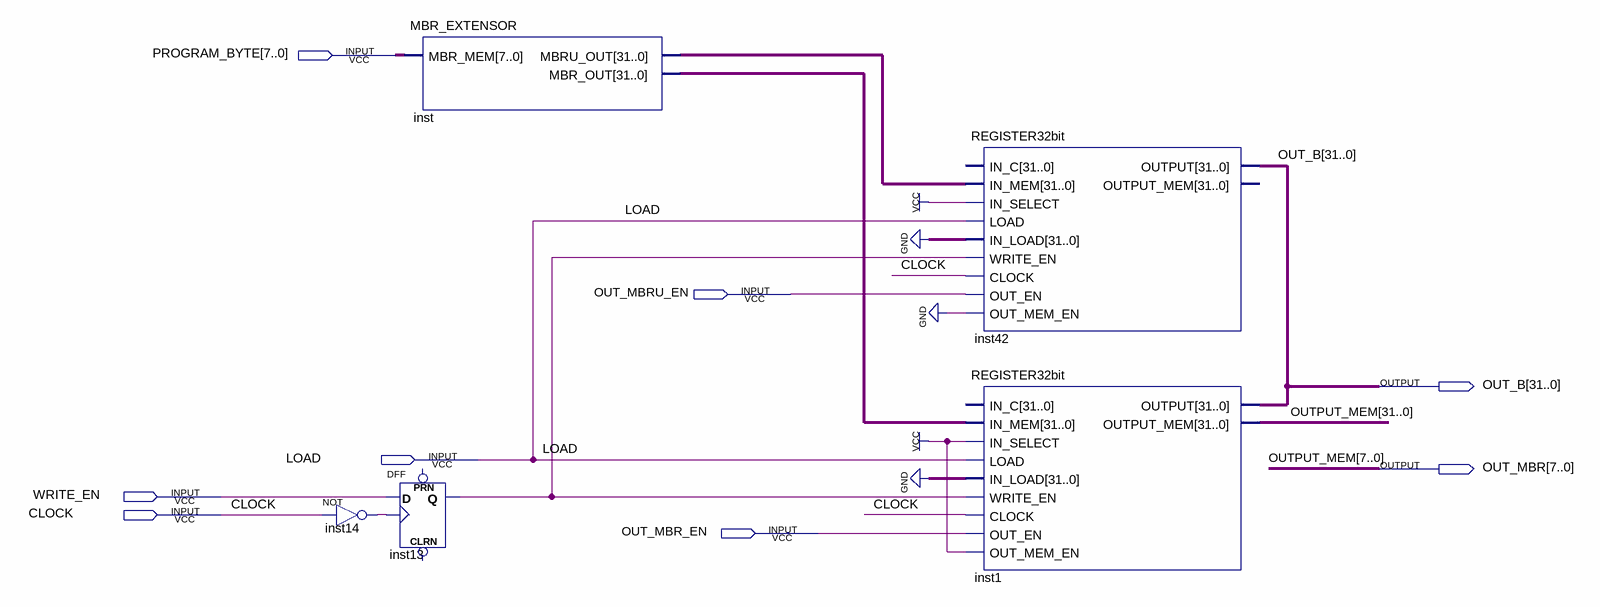
[diagram p0: schematic sheet]
// Quartus schematic MBR.bdf as structural Verilog: 5 symbols, 8 pins
module MBR (
  input  [7:0] PROGRAM_BYTE,
  input  OUT_MBRU_EN,
  input  LOAD,
  input  WRITE_EN,
  input  CLOCK,
  input  OUT_MBR_EN,
  output [31:0] OUT_B,
  output [7:0] OUT_MBR
);

  wire inst13_q, inst14_out;
  wire [31:0] inst_mbr_out, inst_mbru_out;
  wire [31:8] OUTPUT_MEM;

  DFF inst13 (.CLK(inst14_out), .D(WRITE_EN), .Q(inst13_q));  // open: CLRN, PRN
  not inst14 (inst14_out, CLOCK);
  MBR_EXTENSOR inst (.MBR_MEM(PROGRAM_BYTE), .MBRU_OUT(inst_mbru_out), .MBR_OUT(inst_mbr_out));
  REGISTER32bit inst42 (
    .IN_MEM(inst_mbru_out), .IN_SELECT(1'b1), .LOAD(LOAD), .IN_LOAD({32{1'b0}}), .WRITE_EN(inst13_q),
    .CLOCK(CLOCK), .OUT_EN(OUT_MBRU_EN), .OUT_MEM_EN(1'b0), .OUTPUT(OUT_B));  // open: IN_C, OUTPUT_MEM
  REGISTER32bit inst1 (
    .IN_MEM(inst_mbr_out), .IN_SELECT(1'b1), .LOAD(LOAD), .IN_LOAD({32{1'b0}}), .WRITE_EN(inst13_q),
    .CLOCK(CLOCK), .OUT_EN(OUT_MBR_EN), .OUT_MEM_EN(1'b1), .OUTPUT(OUT_B), .OUTPUT_MEM({OUTPUT_MEM, OUT_MBR}));  // open: IN_C

  // Other names for the same wires on the sheet: OUTPUT_MEM[7:0] = OUT_MBR
endmodule
